# EAGLE design ESP32-ng (EAGLE 9.6.2)
DESCRIPTION: microOBD 200 OBD-II Module; HW_REV: 1.4; PCB_REV: C; PCB_SPEC1: Layer Count: 4; PCB_SPEC2: Size: 1.3" x 0.59"; PCB_SPEC3: Finish Thickness: 0.049" - 0.052"; PCB_SPEC4: Copper Weight: 1oz; TITLE: STM1120
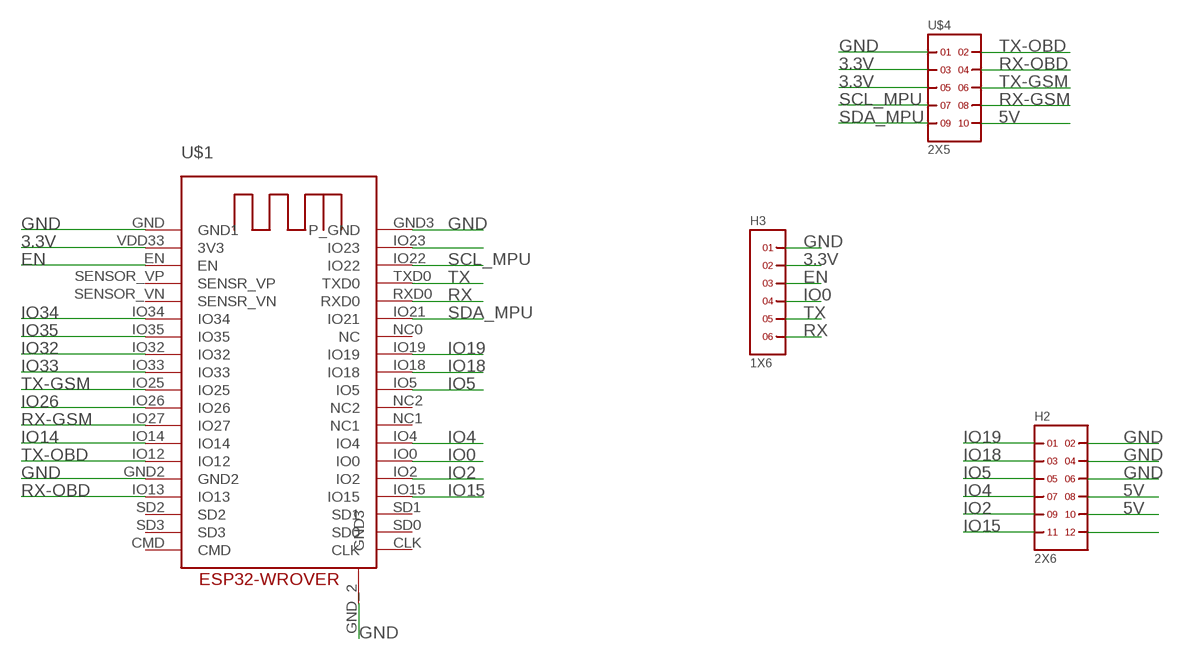
[diagram p0: schematic, sheet 1]

## Parts
H2  2X6  [2X6]
H3  1X6  [1X6]
U$1  ESP32-WROVER  [ESP32-WROVER]
U$4  2X5  [2X5]

## Nets
3.3V [highpower]: H3.2 U$1.VDD33(3V3) U$4.3 U$4.5
5V [highpower]: H2.8 H2.10 U$4.10
EN [highpower]: H3.3 U$1.EN
GND: H2.2 H2.4 H2.6 H3.1 U$1.GND2 U$1.GND3(P_GND) U$1.GND(GND1) U$1.GND_2(GND3) U$4.1
IO0: H3.4 U$1.IO0
IO2: H2.9 U$1.IO2
IO4: H2.7 U$1.IO4
IO5: H2.5 U$1.IO5
IO14: U$1.IO14
IO15: H2.11 U$1.IO15
IO18: H2.3 U$1.IO18
IO19: H2.1 U$1.IO19
IO26: U$1.IO26
IO32: U$1.IO32
IO33: U$1.IO33
IO34: U$1.IO34
IO35: U$1.IO35
N$28: H2.12
N$51: U$1.IO23
RX: H3.6 U$1.RXD0
RX-GSM: U$1.IO27 U$4.8
RX-OBD: U$1.IO13 U$4.4
SCL_MPU: U$1.IO22 U$4.7
SDA_MPU: U$1.IO21 U$4.9
TX: H3.5 U$1.TXD0
TX-GSM: U$1.IO25 U$4.6
TX-OBD: U$1.IO12 U$4.2
Unconnected: U$1.CLK U$1.CMD U$1.NC0(NC) U$1.NC1 U$1.NC2 U$1.SD0 U$1.SD1 U$1.SD2 U$1.SD3 U$1.SENSOR_VN(SENSR_VN) U$1.SENSOR_VP(SENSR_VP)

## Library data of the parts
H2 = headers(.1in):2X6
H3 = headers(.1in):1X6
U$1 = ESP32-Wrover:ESP32-WROVER
U$4 = headers(2mm):2X5

## Net classes
1 highpower: width 0.305 mm

## Board
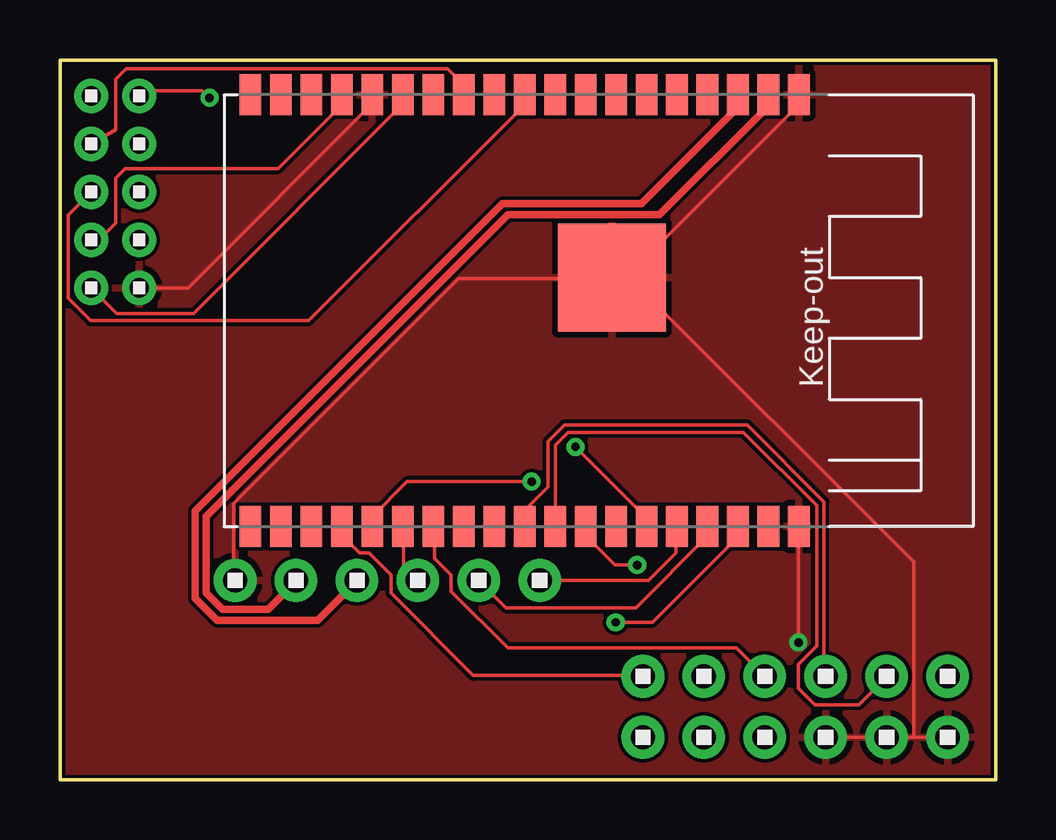
[diagram p1: board, top side]
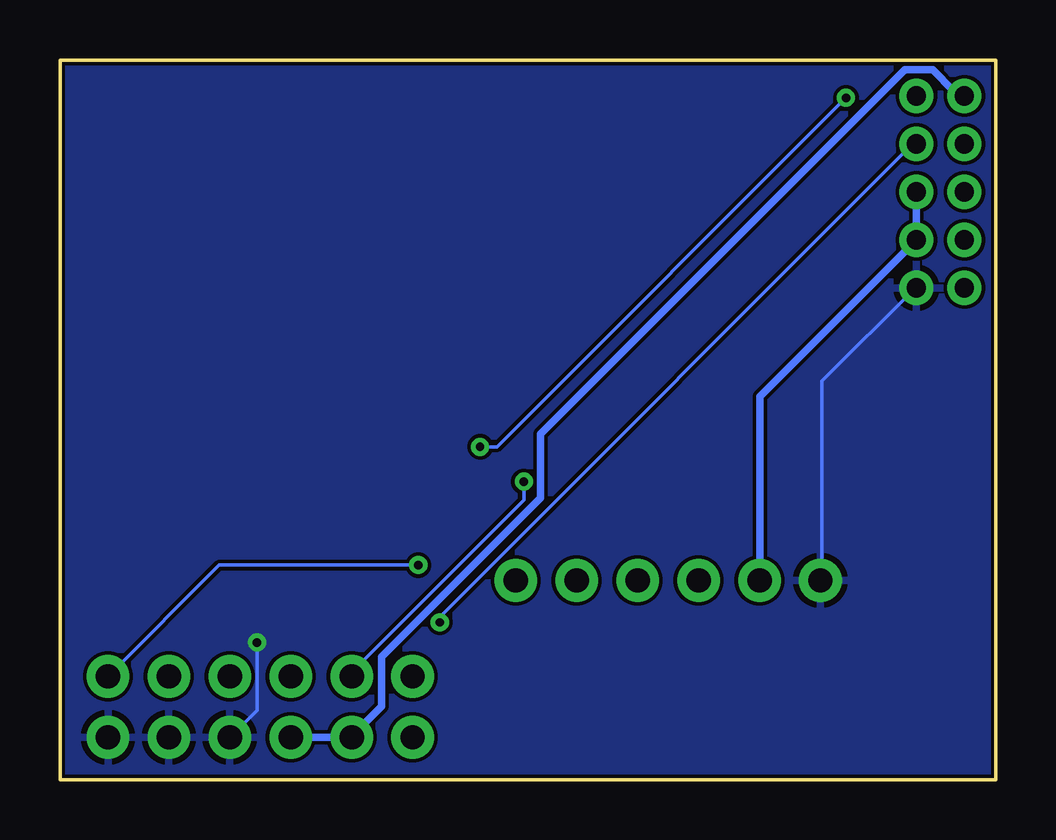
[diagram p2: board, bottom side, seen from below]

Size 39 x 30 mm. Coordinates in mm from the lower left corner, seen from the top.
Outline: 0,0 39,0 39,30 0,30 0,0
Copper layers (1*16): Top 0.035mm / dielectric 1.5mm / Bottom 0.035mm
Design rules "default *": minimum track width 6mil, minimum drill 0.35mm, track to track 6mil, track to pad 6mil, pad to pad 6mil, via to via 6mil, smd to smd 6mil, copper to edge 8mil, drill to drill 8mil, minimum pad ring 10mil, minimum via ring 8mil, stop-mask expansion 4mil, vias tented up to drill 0mil, thermal gap 10mil
Milling: 4 lines

### Footprints (pad centres in the part's own frame; a part is rotated, then mirrored left to right if it is on the bottom)
2X6 = drill 1.016 pad 1.778: 1 0,0; 2 0,2.54; 3 2.54,0; 4 2.54,2.54; 5 5.08,0; 6 5.08,2.54; 7 7.62,0; 8 7.62,2.54; 9 10.16,0; 10 10.16,2.54; 11 12.7,0; 12 12.7,2.54
1X6 = drill 1.016 pad 1.778: 1 0,0; 2 2.54,0; 3 5.08,0; 4 7.62,0; 5 10.16,0; 6 12.7,0
ESP32-WROVER = smd 1.7 x 0.9: CLK 18,1.27; CMD 0,1.27; EN 0,21.59; GND 0,24.13; GND3 18,24.13; GND_2 0,6.35; IO0 18,7.62; IO2 18,6.35; IO4 18,8.89; IO5 18,12.7; IO12 0,7.62; IO13 0,5.08; IO14 0,8.89; IO15 18,5.08; IO18 18,13.97; IO19 18,15.24; IO21 18,17.78; IO22 18,21.59; IO23 18,22.86; IO25 0,12.7; IO26 0,11.43; IO27 0,10.16; IO32 0,15.24; IO33 0,13.97; IO34 0,17.78; IO35 0,16.51; NC0 18,16.51; NC1 18,10.16; NC2 18,11.43; RXD0 18,19.05; SD0 18,2.54; SD1 18,3.81; SD2 0,3.81; SD3 0,2.54; SENSOR_VN 0,19.05; SENSOR_VP 0,20.32; TXD0 18,20.32; VDD33 0,22.86 | smd 4.5 x 4.5: GND2 7.62,16.34
2X5 = drill 0.8 pad 1.422: 1 -4,-1; 2 -4,1; 3 -2,-1; 4 -2,1; 5 0,-1; 6 0,1; 7 2,-1; 8 2,1; 9 4,-1; 10 4,1

### Placement (x,y rotation side)
H2  37,4.3 180 top
H3  7.3,8.3 0 top
U$1  6.67,28.55 270 top
U$4  2.3,24.5 90 top

### Tracks (layer width: path | path; a pad name or v marks a point on that pad's centre or on a via)
3.3V
  Top 0.305: U$1.VDD33 29.49,28.5 29.49,28.04 24.99,23.55 18.67,23.55 6.1,10.97 6.1,7.77 6.78,7.09 8.69,7.09 9.83,8.23 H3.2
  Bottom 0.305: H3.2 9.83,15.97 U$4.3 U$4.5
5V
  Bottom 0.305: U$4.10 1.52,28.72 1.76,28.72 2.62,29.59 3.79,29.59 18.97,14.4 18.97,11.73 25.6,5.11 25.6,3.05 26.82,1.83 H2.10 26.98,1.75 29.34,1.75 H2.8
EN
  Top 0.305: U$1.EN 28.19,28.5 28.19,27.96 24.23,24 18.44,24 5.64,11.2 5.64,7.54 6.55,6.63 10.74,6.63 12.34,8.23 H3.3
GND  (via drill 0.35)
  Top 0.152: U$1.GND_2 12.95,28.5 12.95,28.12 5.34,20.5 U$4.1 | 35.59,1.75 36.96,1.75 H2.2 | 35.59,1.75 34.52,1.75 H2.4 34.44,1.75 H2.6 | v30.79,5.71 30.79,10.52 U$1.GND3 | U$1.GND 30.79,28.5 30.79,28.12 23.62,20.95 23.01,20.95 U$1.GND2 | 35.59,1.75 35.59,9.07 23.7,20.95 U$1.GND2 | H3.1 7.24,8.31 7.24,11.51 16.61,20.88 22.94,20.88 U$1.GND2
  Bottom 0.152: H3.1 7.24,8.31 7.24,16.61 3.35,20.5 U$4.1 | v30.79,5.71 30.79,2.9 31.85,1.83 H2.6
  pour Top: -0.6,30.8 40.4,30.8 40.8,31.2 40.8,-1.5 40.1,-2.2 0.3,-2.2 -2.4,0.5 -0.6,2.3
  pour Bottom: -1.7,32.4 41.6,32.4 42.6,31.4 42.6,-0.5 40.5,-2.6 -1.4,-2.6 -2.9,-1.1 -2.9,31.2
IO0
  Top 0.152: U$1.IO0 14.33,10.52 14.33,8.84 14.86,8.31 H3.4
IO2  (via drill 0.35)
  Top 0.152: v19.66,12.42 14.48,12.42 13.03,10.97 13.03,10.59 U$1.IO2
  Bottom 0.152: v19.66,12.42 19.66,11.66 26.82,4.5 26.82,4.34 H2.9
IO4
  Top 0.152: U$1.IO4 15.62,10.52 15.62,9.22 16.31,8.53 16.31,7.85 18.67,5.49 28.19,5.49 29.34,4.34 H2.7
IO5
  Top 0.152: U$1.IO5 19.43,10.59 19.43,11.28 20.34,12.19 20.34,14.1 21.03,14.78 28.65,14.78 31.85,11.58 31.85,4.34 H2.5
IO15
  Top 0.152: U$1.IO15 11.81,10.52 11.81,10.13 12.5,9.45 12.88,9.45 13.79,8.53 13.79,7.77 17.22,4.34 24.23,4.34 H2.11
IO18
  Top 0.152: U$1.IO18 20.65,10.59 20.65,13.95 21.18,14.48 28.5,14.48 31.55,11.43 31.55,5.56 30.79,4.8 30.79,3.81 31.47,3.12 33.3,3.12 34.44,4.27 H2.3
IO19  (via drill 0.35)
  Top 0.152: v24.06,8.94 23.14,8.94 21.95,10.13 21.95,10.52 U$1.IO19
  Bottom 0.152: v24.06,8.94 32.36,8.94 36.96,4.34 H2.1
RX
  Top 0.152: U$1.RXD0 25.68,10.52 25.68,9.45 24.54,8.31 20.04,8.31 H3.6
RX-GSM
  Top 0.152: U$1.IO27 16.76,28.57 16.76,29.03 16.15,29.64 2.75,29.64 2.31,29.2 2.31,27.09 U$4.8
RX-OBD
  Top 0.152: U$1.IO13 11.73,28.5 11.73,28.12 9.09,25.48 2.72,25.48 2.31,25.07 2.31,23.19 1.62,22.5 U$4.4
SCL_MPU  (via drill 0.35)
  Top 0.152: v23.16,6.55 24.69,6.55 28.19,10.06 28.19,10.52 U$1.IO22
  Bottom 0.152: v23.16,6.55 23.16,6.78 3.32,26.63 U$4.7
SDA_MPU  (via drill 0.35)
  Top 0.152: v21.49,13.87 24.38,10.97 24.38,10.59 U$1.IO21 | v6.23,28.42 5.93,28.72 3.52,28.72 U$4.9
  Bottom 0.152: v21.49,13.87 20.79,13.87 v6.23,28.42
TX
  Top 0.152: U$1.TXD0 26.98,10.52 26.98,10.13 24,7.16 18.59,7.16 17.53,8.23 H3.5
TX-GSM
  Top 0.152: U$1.IO25 19.36,28.5 19.36,28.12 10.36,19.13 1.27,19.13 0.33,20.06 0.33,23.53 U$4.6
TX-OBD
  Top 0.152: U$1.IO12 14.25,28.5 14.25,28.12 5.56,19.43 2.37,19.43 U$4.2